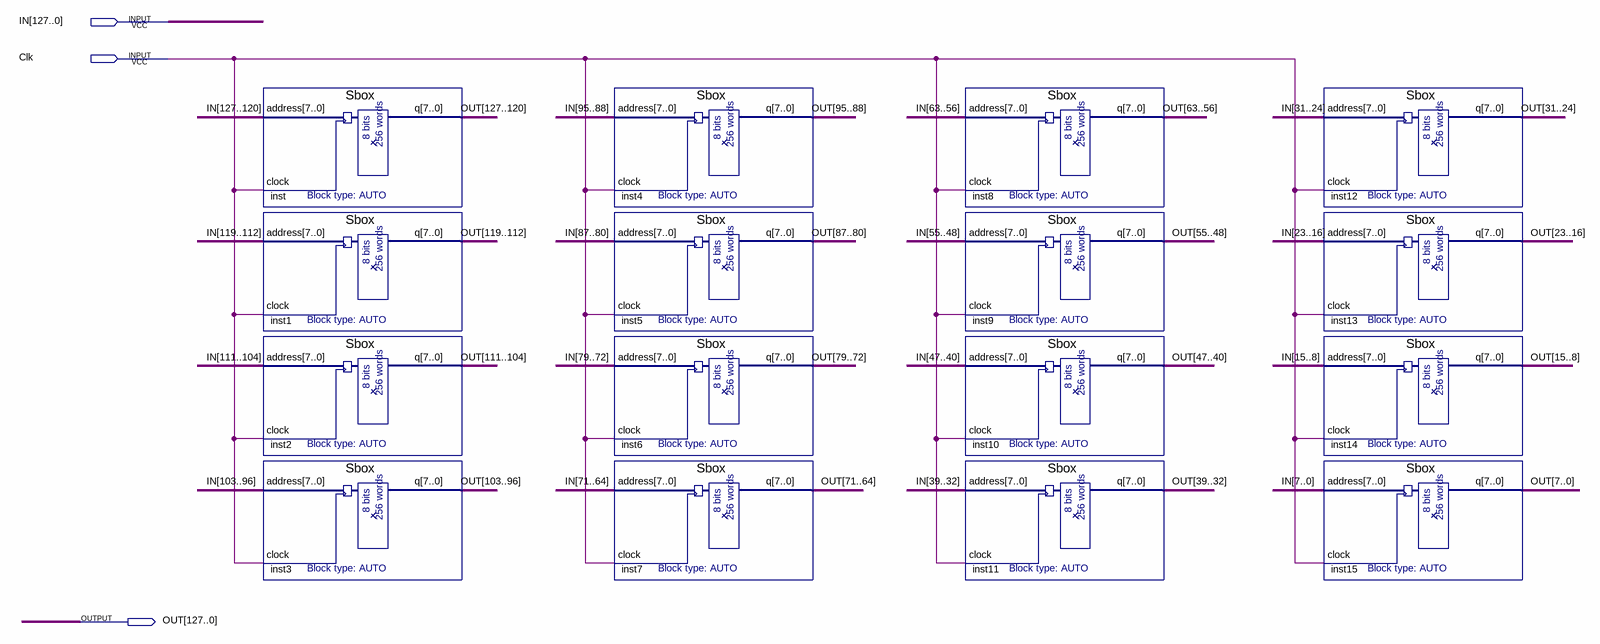
[diagram p0: schematic sheet]
// Quartus schematic SubBytes.bdf as structural Verilog: 16 symbols, 3 pins
module SubBytes (
  input  [127:0] IN,
  input  Clk,
  output [127:0] OUT
);

  Sbox inst (.address(IN[127:120]), .clock(Clk), .q(OUT[127:120]));
  Sbox inst1 (.address(IN[119:112]), .clock(Clk), .q(OUT[119:112]));
  Sbox inst2 (.address(IN[111:104]), .clock(Clk), .q(OUT[111:104]));
  Sbox inst3 (.address(IN[103:96]), .clock(Clk), .q(OUT[103:96]));
  Sbox inst4 (.address(IN[95:88]), .clock(Clk), .q(OUT[95:88]));
  Sbox inst5 (.address(IN[87:80]), .clock(Clk), .q(OUT[87:80]));
  Sbox inst6 (.address(IN[79:72]), .clock(Clk), .q(OUT[79:72]));
  Sbox inst7 (.address(IN[71:64]), .clock(Clk), .q(OUT[71:64]));
  Sbox inst8 (.address(IN[63:56]), .clock(Clk), .q(OUT[63:56]));
  Sbox inst9 (.address(IN[55:48]), .clock(Clk), .q(OUT[55:48]));
  Sbox inst10 (.address(IN[47:40]), .clock(Clk), .q(OUT[47:40]));
  Sbox inst11 (.address(IN[39:32]), .clock(Clk), .q(OUT[39:32]));
  Sbox inst12 (.address(IN[31:24]), .clock(Clk), .q(OUT[31:24]));
  Sbox inst13 (.address(IN[23:16]), .clock(Clk), .q(OUT[23:16]));
  Sbox inst14 (.address(IN[15:8]), .clock(Clk), .q(OUT[15:8]));
  Sbox inst15 (.address(IN[7:0]), .clock(Clk), .q(OUT[7:0]));
endmodule
